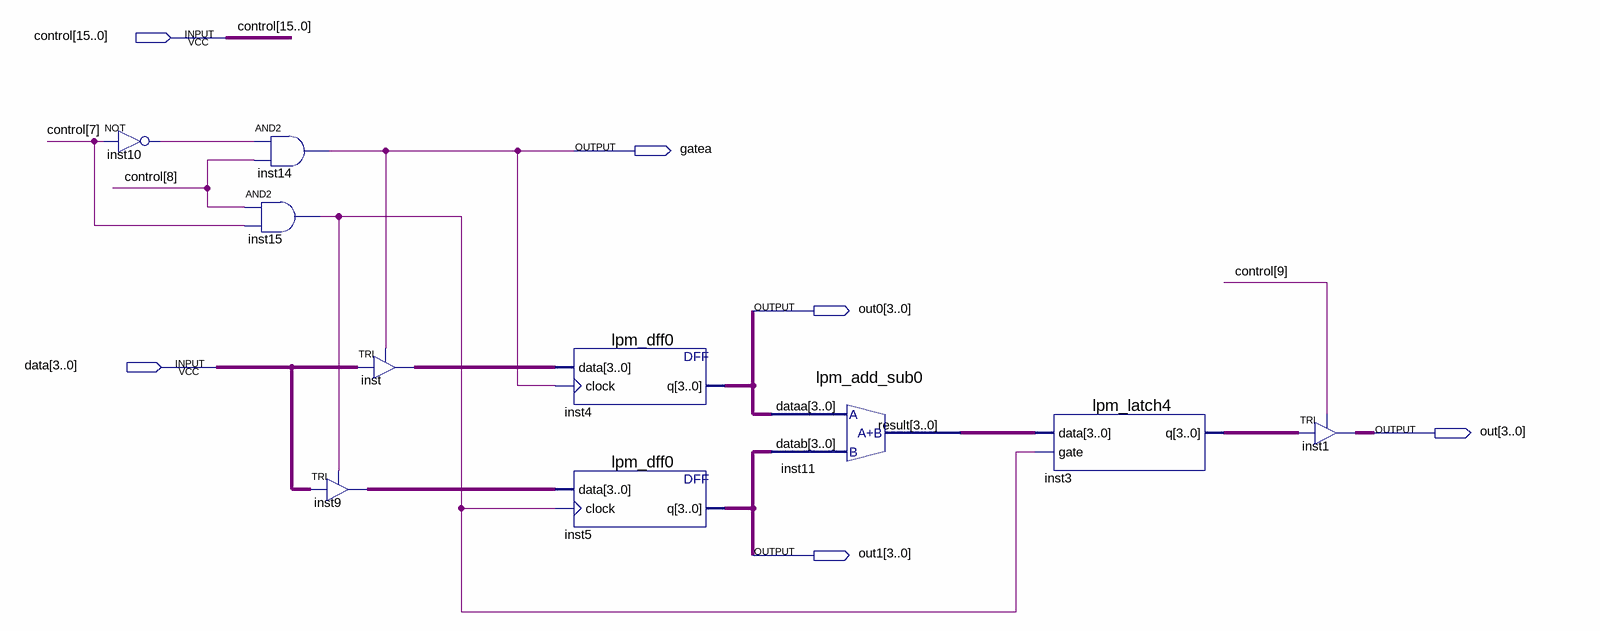
[diagram p0: schematic sheet]
// Quartus schematic sum.bdf as structural Verilog: 10 symbols, 6 pins
module sum (
  input  [15:0] control,
  input  [3:0] data,
  output gatea,
  output [3:0] out0,
  output [3:0] out,
  output [3:0] out1
);

  wire inst10_out, inst15_out;
  wire [3:0] inst3_q, inst9_out, inst11_result, inst_out;

  not inst10 (inst10_out, control[7]);
  and inst14 (gatea, inst10_out, control[8]);
  and inst15 (inst15_out, control[8], control[7]);
  TRI inst9[3:0] (.IN(data), .OE(inst15_out), .OUT(inst9_out));
  TRI inst[3:0] (.IN(data), .OE(gatea), .OUT(inst_out));
  lpm_dff0 inst4 (.data(inst_out), .clock(gatea), .q(out0));
  lpm_dff0 inst5 (.data(inst9_out), .clock(inst15_out), .q(out1));
  lpm_add_sub0 inst11 (.dataa(out0), .datab(out1), .result(inst11_result));
  lpm_latch4 inst3 (.data(inst11_result), .gate(inst15_out), .q(inst3_q));
  TRI inst1[3:0] (.IN(inst3_q), .OE(control[9]), .OUT(out));
endmodule
